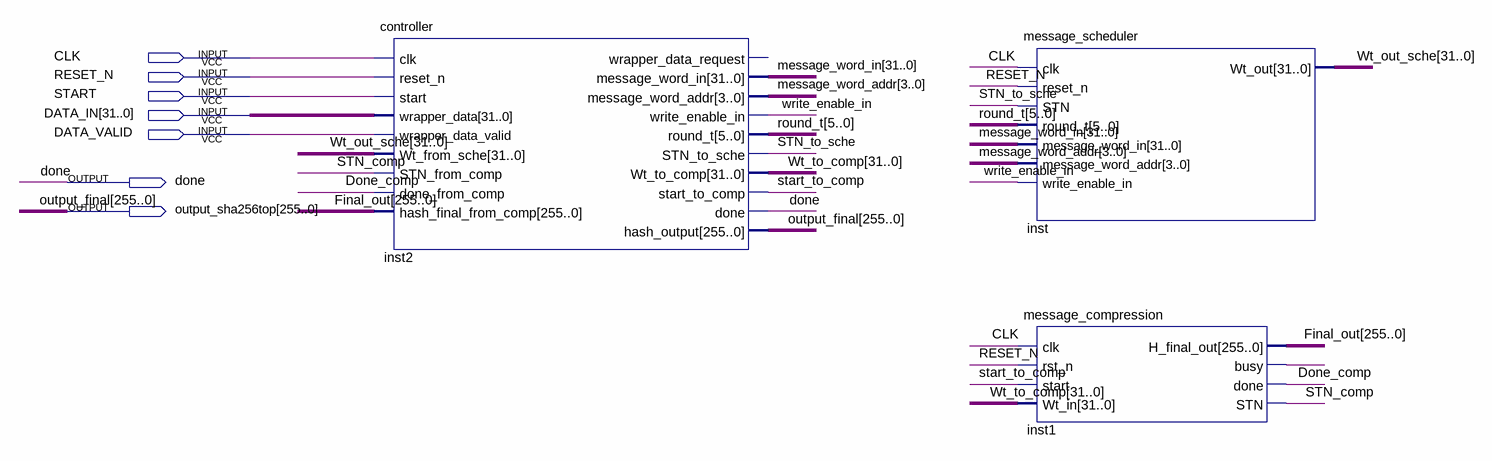
[diagram p0: schematic sheet]
// Quartus schematic sha256_optimizePowerArea.bdf as structural Verilog: 3 symbols, 7 pins
module sha256_optimizePowerArea (
  input  CLK,
  input  RESET_N,
  input  START,
  input  [31:0] DATA_IN,
  input  DATA_VALID,
  output done,
  output [255:0] output_sha256top
);

  wire Done_comp, inst1_busy, start_to_comp, STN_comp, STN_to_sche, write_enable_in;
  wire [3:0] message_word_addr;
  wire [5:0] round_t;
  wire [31:0] message_word_in, Wt_out_sche, Wt_to_comp;
  wire [255:0] Final_out;

  controller inst2 (
    .clk(CLK), .reset_n(RESET_N), .start(START), .wrapper_data(DATA_IN), .wrapper_data_valid(DATA_VALID),
    .Wt_from_sche(Wt_out_sche), .STN_from_comp(STN_comp), .done_from_comp(Done_comp),
    .hash_final_from_comp(Final_out), .message_word_in(message_word_in),
    .message_word_addr(message_word_addr), .write_enable_in(write_enable_in), .round_t(round_t),
    .STN_to_sche(STN_to_sche), .Wt_to_comp(Wt_to_comp), .start_to_comp(start_to_comp), .done(done),
    .hash_output(output_sha256top));  // open: wrapper_data_request
  message_scheduler inst (
    .clk(CLK), .reset_n(RESET_N), .STN(STN_to_sche), .round_t(round_t), .message_word_in(message_word_in),
    .message_word_addr(message_word_addr), .write_enable_in(write_enable_in), .Wt_out(Wt_out_sche));
  message_compression inst1 (
    .clk(CLK), .rst_n(RESET_N), .start(start_to_comp), .Wt_in(Wt_to_comp), .H_final_out(Final_out),
    .busy(inst1_busy), .done(Done_comp), .STN(STN_comp));

  // Other names for the same wires on the sheet: output_final[255:0] = output_sha256top
endmodule
